# Altium schematic sheet CPU_ETH_RGMII1_SW.SchDoc
size 420 x 297 mm; SheetNumber: 17; SheetTotal: 32; DocumentTypeShort: Э3; DocumentInvertoryNumber: ㅤ
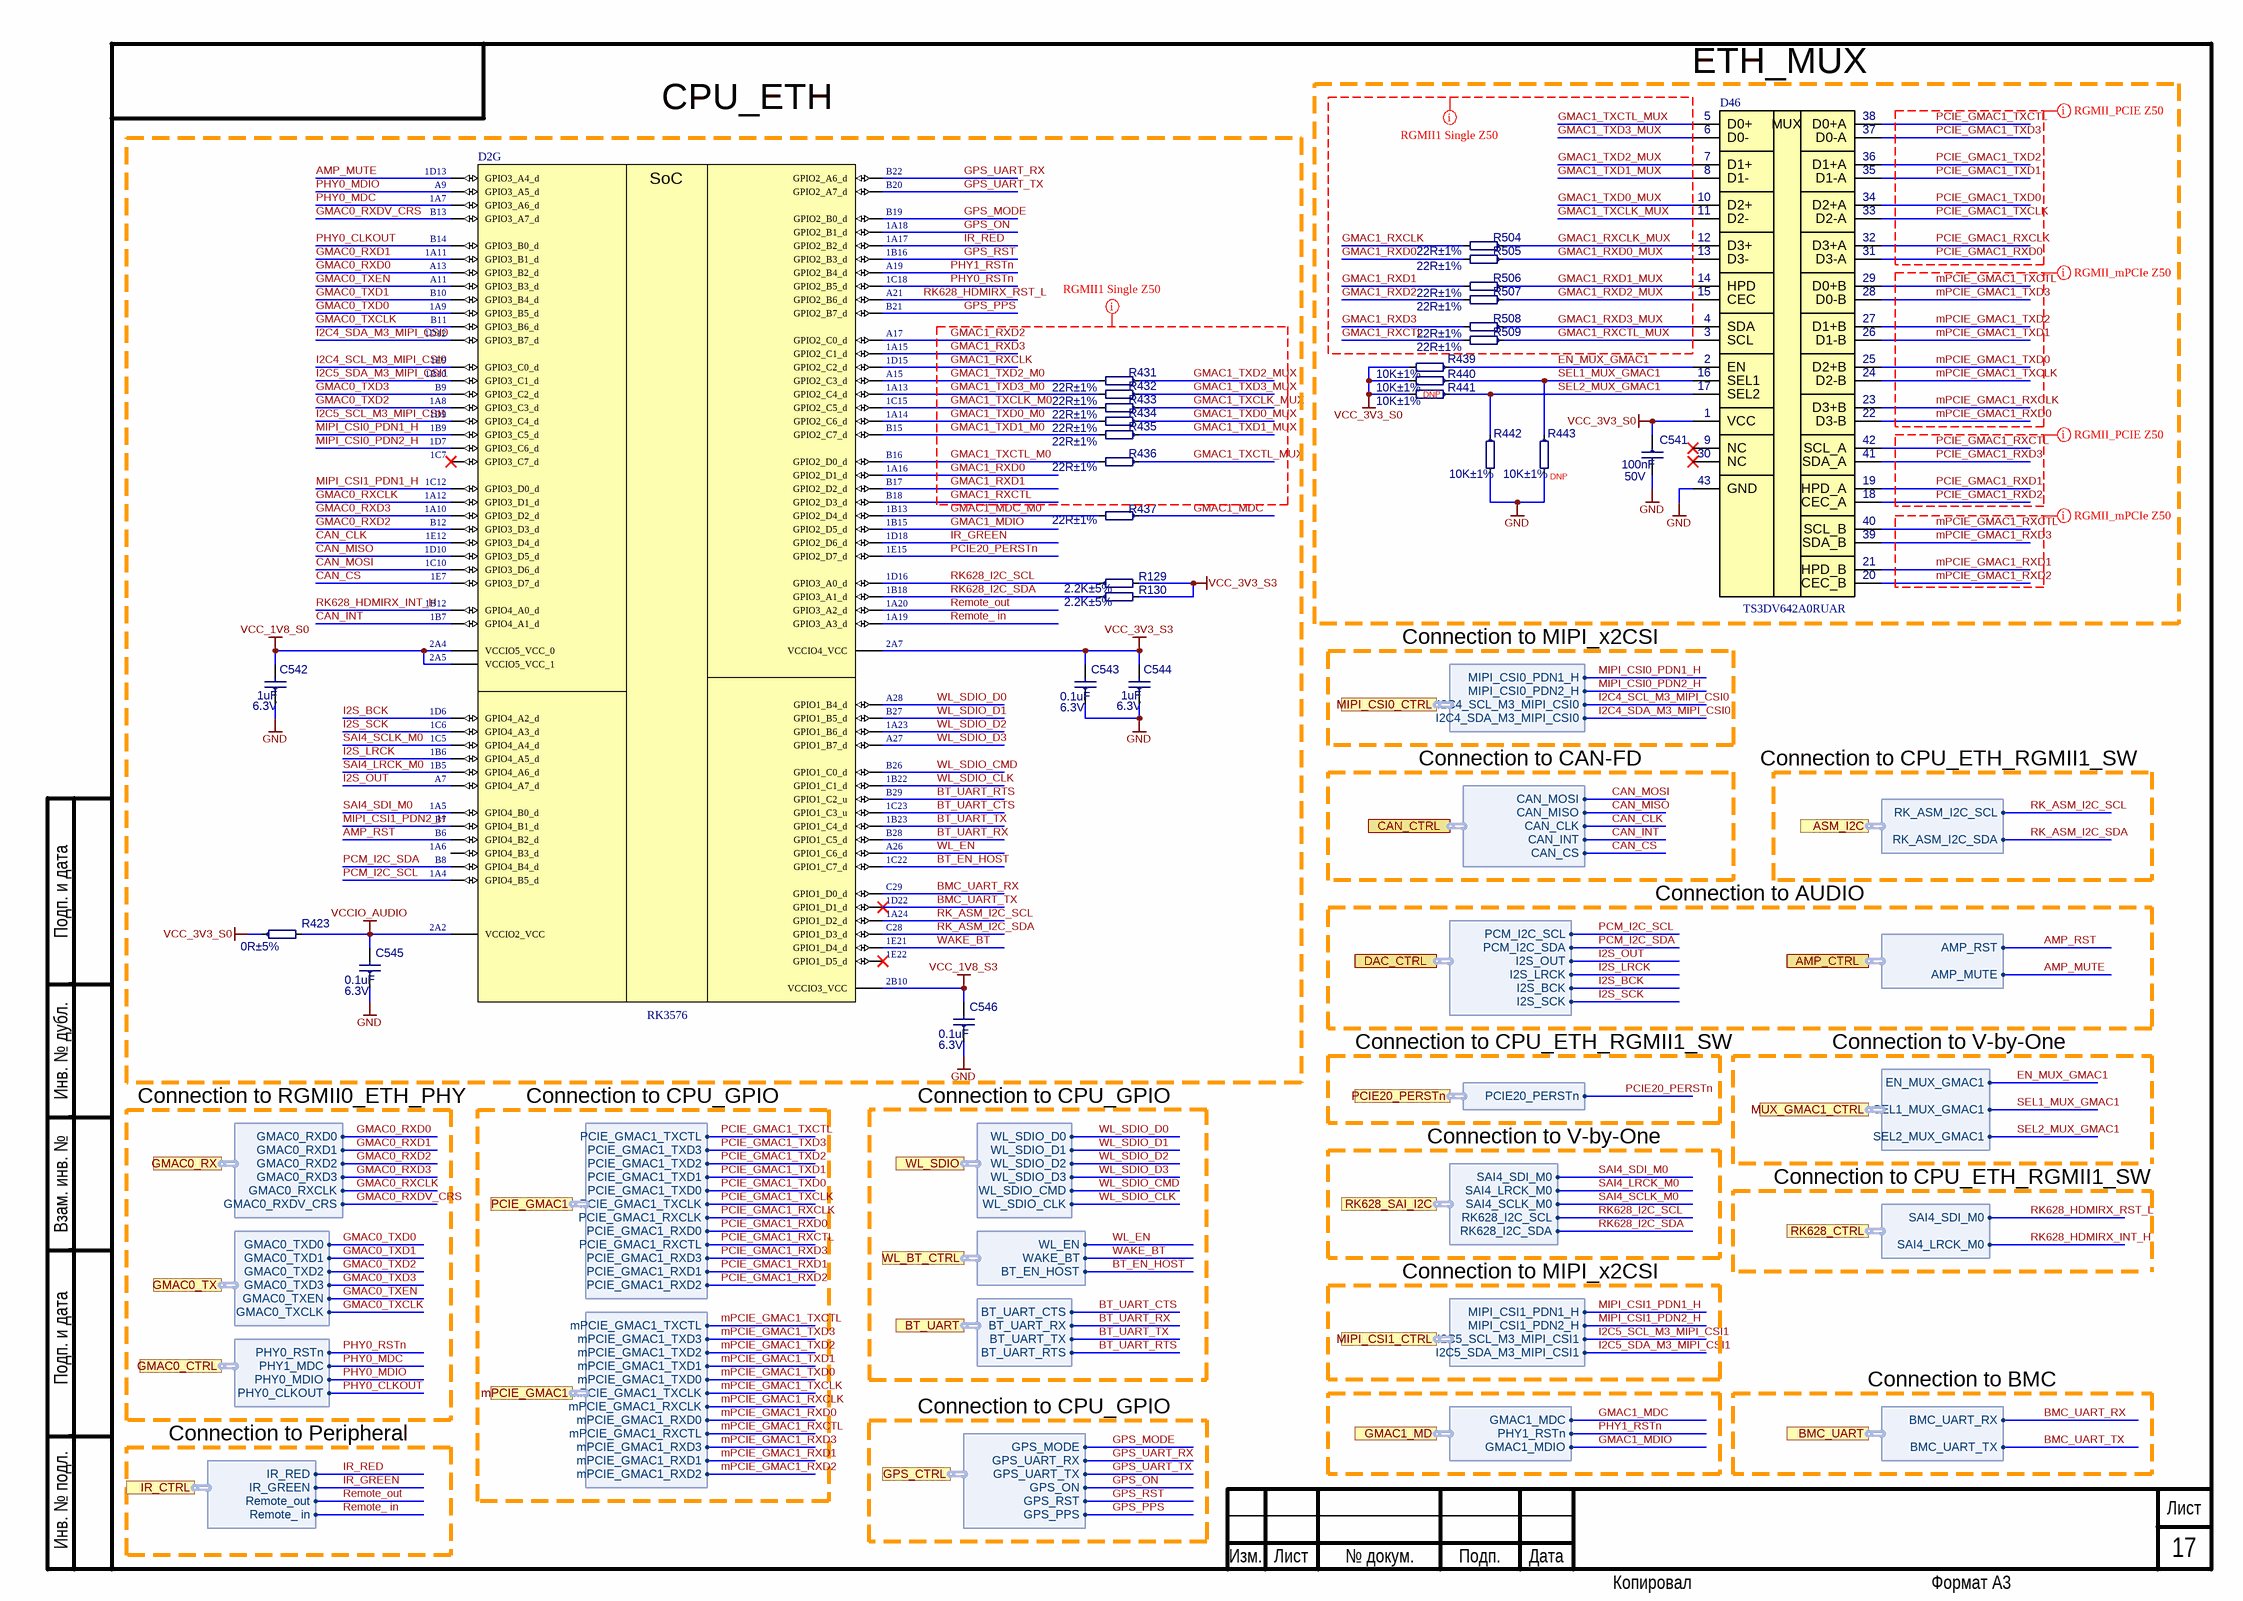
[diagram p0: CPU_ETH_RGMII1_SW.SchDoc]

## Parts
C541  100nF  Voltage: 50V  [C0402]
C542  1uF  Voltage: 6.3V  [C0201]
C543  0.1uF  Voltage: 6.3V  [C0201]
C544  1uF  Voltage: 6.3V  [C0201]
C545  0.1uF  Voltage: 6.3V  [C0201]
C546  0.1uF  Voltage: 6.3V  [C0201]
D2  RK3576  [BGAFCCSP698L]  (part G of 7)
D46  TS3DV642A0RUAR  [TS3DV642A0RUAR]
R129  2.2K±5%  [R0402]
R130  2.2K±5%  [R0402]
R423  0R±5%  [R0402]
R431  22R±1%  [R0402]
R432  22R±1%  [R0402]
R433  22R±1%  [R0402]
R434  22R±1%  [R0402]
R435  22R±1%  [R0402]
R436  22R±1%  [R0402]
R437  22R±1%  [R0402]
R439  10K±1%  [R0402]
R440  10K±1%  [R0402]
R441  10K±1%  [R0402]
R442  10K±1%  [R0402]
R443  10K±1%  [R0402]
R504  22R±1%  [R0402]
R505  22R±1%  [R0402]
R506  22R±1%  [R0402]
R507  22R±1%  [R0402]
R508  22R±1%  [R0402]
R509  22R±1%  [R0402]

## Ports
AMP_CTRL (harness AMP_CTRL), ASM_I2C (harness ASM_I2C), BMC_UART (harness BMC_UART), BT_UART (harness BT_UART), CAN_CTRL (harness CAN_CTRL), DAC_CTRL (harness DAC_CTRL), GMAC0_CTRL (harness GMAC0_CTRL), GMAC0_RX (harness GMAC0_RX), GMAC0_TX (harness GMAC0_TX), GMAC1_MD (harness GMAC1_MD), GPS_CTRL (harness GPS_CTRL), IR_CTRL (harness IR_CTRL), MIPI_CSI0_CTRL (harness MIPI_CSI0_CTRL), MIPI_CSI1_CTRL (harness MIPI_CSI1_CTRL), mPCIE_GMAC1 (harness mPCIE_GMAC1), MUX_GMAC1_CTRL (harness MUX_GMAC1_CTRL), PCIE20_PERSTn (harness PCIE20_PERSTn), PCIE_GMAC1 (harness PCIE_GMAC1), RK628_CTRL (harness RK628_CTRL), RK628_SAI_I2C (harness RK628_SAI_I2C), WL_BT_CTRL (harness WL_BT_CTRL), WL_SDIO (harness WL_SDIO)

## Harnesses
GMAC0_RX: GMAC0_RXD1, GMAC0_RXD2, GMAC0_RXD3, GMAC0_RXD0, GMAC0_RXCLK, GMAC0_RXDV_CRS
GMAC0_TX: GMAC0_TXD1, GMAC0_TXD2, GMAC0_TXD3, GMAC0_TXD0, GMAC0_TXEN, GMAC0_TXCLK
GMAC0_CTRL: PHY0_RSTn, PHY1_MDC, PHY0_MDIO, PHY0_CLKOUT
PCIE_GMAC1: PCIE_GMAC1_TXD3, PCIE_GMAC1_TXD2, PCIE_GMAC1_TXD1, PCIE_GMAC1_TXCTL, PCIE_GMAC1_TXD0, PCIE_GMAC1_TXCLK, PCIE_GMAC1_RXCLK, PCIE_GMAC1_RXD0, PCIE_GMAC1_RXCTL, PCIE_GMAC1_RXD3, PCIE_GMAC1_RXD1, PCIE_GMAC1_RXD2
mPCIE_GMAC1: mPCIE_GMAC1_TXD3, mPCIE_GMAC1_TXD2, mPCIE_GMAC1_TXD1, mPCIE_GMAC1_TXCTL, mPCIE_GMAC1_TXD0, mPCIE_GMAC1_TXCLK, mPCIE_GMAC1_RXCLK, mPCIE_GMAC1_RXD0, mPCIE_GMAC1_RXCTL, mPCIE_GMAC1_RXD3, mPCIE_GMAC1_RXD1, mPCIE_GMAC1_RXD2
WL_SDIO: WL_SDIO_D1, WL_SDIO_D2, WL_SDIO_D3, WL_SDIO_D0, WL_SDIO_CMD, WL_SDIO_CLK
BT_UART: BT_UART_CTS, BT_UART_RX, BT_UART_TX, BT_UART_RTS
RK628_SAI_I2C: SAI4_LRCK_M0, SAI4_SCLK_M0, SAI4_SDI_M0, RK628_I2C_SCL, RK628_I2C_SDA
MIPI_CSI1_CTRL: I2C5_SDA_M3_MIPI_CSI1, I2C5_SCL_M3_MIPI_CSI1, MIPI_CSI1_PDN2_H, MIPI_CSI1_PDN1_H
MUX_GMAC1_CTRL: SEL1_MUX_GMAC1, EN_MUX_GMAC1, SEL2_MUX_GMAC1
RK628_CTRL: SAI4_LRCK_M0, SAI4_SDI_M0
WL_BT_CTRL: WAKE_BT, WL_EN, BT_EN_HOST
GPS_CTRL: GPS_MODE, GPS_UART_TX, GPS_UART_RX, GPS_ON, GPS_RST, GPS_PPS
AMP_CTRL: AMP_MUTE, AMP_RST
DAC_CTRL: PCM_I2C_SDA, PCM_I2C_SCL, I2S_OUT, I2S_LRCK, I2S_BCK, I2S_SCK
CAN_CTRL: CAN_MISO, CAN_MOSI, CAN_CLK, CAN_INT, CAN_CS
ASM_I2C: RK_ASM_I2C_SCL, RK_ASM_I2C_SDA
BMC_UART: BMC_UART_RX, BMC_UART_TX
GMAC1_MD: GMAC1_MDC, GMAC1_MDIO, PHY1_RSTn
PCIE20_PERSTn: PCIE20_PERSTn
IR_CTRL: Remote_out, IR_GREEN, IR_RED, Remote_ in
MIPI_CSI0_CTRL: I2C4_SDA_M3_MIPI_CSI0, I2C4_SCL_M3_MIPI_CSI0, MIPI_CSI0_PDN2_H, MIPI_CSI0_PDN1_H

## Nets
GND: C541.2 C542.1 C543.1 C544.1 C545.1 C546.1 D46.43(GND) R442.2 R443.2
VCC_1V8_S0: C542.2 D2.2A4(VCCIO5_VCC_0) D2.2A5(VCCIO5_VCC_1)
VCC_1V8_S3: C546.2 D2.2B10(VCCIO3_VCC)
VCC_3V3_S0: C541.1 D46.1(VCC) R423.1 R439.2 R440.2 R441.2
VCC_3V3_S3: C543.2 C544.2 D2.2A7(VCCIO4_VCC) R129.2 R130.2
VCCIO_AUDIO: C545.2 D2.2A2(VCCIO2_VCC) R423.2
AMP_MUTE: D2.1D13(GPIO3_A4_d) ; port AMP_CTRL.AMP_MUTE
AMP_RST: D2.B6(GPIO4_B2_d) ; port AMP_CTRL.AMP_RST
BMC_UART_RX: D2.C29(GPIO1_D0_d) ; port BMC_UART.BMC_UART_RX
BMC_UART_TX: D2.1D22(GPIO1_D1_d) ; port BMC_UART.BMC_UART_TX
BT_EN_HOST: D2.1C22(GPIO1_C7_d) ; port WL_BT_CTRL.BT_EN_HOST
BT_UART_CTS: D2.1C23(GPIO1_C3_u) ; port BT_UART.BT_UART_CTS
BT_UART_RTS: D2.B29(GPIO1_C2_u) ; port BT_UART.BT_UART_RTS
BT_UART_RX: D2.B28(GPIO1_C5_d) ; port BT_UART.BT_UART_RX
BT_UART_TX: D2.1B23(GPIO1_C4_d) ; port BT_UART.BT_UART_TX
CAN_CLK: D2.1E12(GPIO3_D4_d) ; port CAN_CTRL.CAN_CLK
CAN_CS: D2.1E7(GPIO3_D7_d) ; port CAN_CTRL.CAN_CS
CAN_INT: D2.1B7(GPIO4_A1_d) ; port CAN_CTRL.CAN_INT
CAN_MISO: D2.1D10(GPIO3_D5_d) ; port CAN_CTRL.CAN_MISO
CAN_MOSI: D2.1C10(GPIO3_D6_d) ; port CAN_CTRL.CAN_MOSI
EN_MUX_GMAC1: D46.2(EN) R439.1 ; port MUX_GMAC1_CTRL.EN_MUX_GMAC1
GMAC0_RXCLK: D2.1A12(GPIO3_D1_d) ; port GMAC0_RX.GMAC0_RXCLK
GMAC0_RXD0: D2.A13(GPIO3_B2_d) ; port GMAC0_RX.GMAC0_RXD0
GMAC0_RXD1: D2.1A11(GPIO3_B1_d) ; port GMAC0_RX.GMAC0_RXD1
GMAC0_RXD2: D2.B12(GPIO3_D3_d) ; port GMAC0_RX.GMAC0_RXD2
GMAC0_RXD3: D2.1A10(GPIO3_D2_d) ; port GMAC0_RX.GMAC0_RXD3
GMAC0_RXDV_CRS: D2.B13(GPIO3_A7_d) ; port GMAC0_RX.GMAC0_RXDV_CRS
GMAC0_TXCLK: D2.B11(GPIO3_B6_d) ; port GMAC0_TX.GMAC0_TXCLK
GMAC0_TXD0: D2.1A9(GPIO3_B5_d) ; port GMAC0_TX.GMAC0_TXD0
GMAC0_TXD1: D2.B10(GPIO3_B4_d) ; port GMAC0_TX.GMAC0_TXD1
GMAC0_TXD2: D2.1A8(GPIO3_C3_d) ; port GMAC0_TX.GMAC0_TXD2
GMAC0_TXD3: D2.B9(GPIO3_C2_d) ; port GMAC0_TX.GMAC0_TXD3
GMAC0_TXEN: D2.A11(GPIO3_B3_d) ; port GMAC0_TX.GMAC0_TXEN
GMAC1_MDC: R437.1 ; port GMAC1_MD.GMAC1_MDC
GMAC1_MDC_M0: D2.1B13(GPIO2_D4_d) R437.2
GMAC1_MDIO: D2.1B15(GPIO2_D5_d) ; port GMAC1_MD.GMAC1_MDIO
GMAC1_RXCLK: D2.1D15(GPIO2_C2_d) R504.2
GMAC1_RXCLK_MUX: D46.12(D3+) R504.1
GMAC1_RXCTL: D2.B18(GPIO2_D3_d) R509.2
GMAC1_RXCTL_MUX: D46.3(SCL) R509.1
GMAC1_RXD0: D2.1A16(GPIO2_D1_d) R505.2
GMAC1_RXD0_MUX: D46.13(D3-) R505.1
GMAC1_RXD1: D2.B17(GPIO2_D2_d) R506.2
GMAC1_RXD1_MUX: D46.14(HPD) R506.1
GMAC1_RXD2: D2.A17(GPIO2_C0_d) R507.2
GMAC1_RXD2_MUX: D46.15(CEC) R507.1
GMAC1_RXD3: D2.1A15(GPIO2_C1_d) R508.2
GMAC1_RXD3_MUX: D46.4(SDA) R508.1
GMAC1_TXCLK_M0: D2.1C15(GPIO2_C5_d) R433.2
GMAC1_TXCLK_MUX: D46.11(D2-) R433.1
GMAC1_TXCTL_M0: D2.B16(GPIO2_D0_d) R436.2
GMAC1_TXCTL_MUX: D46.5(D0+) R436.1
GMAC1_TXD0_M0: D2.1A14(GPIO2_C6_d) R434.2
GMAC1_TXD0_MUX: D46.10(D2+) R434.1
GMAC1_TXD1_M0: D2.B15(GPIO2_C7_d) R435.2
GMAC1_TXD1_MUX: D46.8(D1-) R435.1
GMAC1_TXD2_M0: D2.A15(GPIO2_C3_d) R431.2
GMAC1_TXD2_MUX: D46.7(D1+) R431.1
GMAC1_TXD3_M0: D2.1A13(GPIO2_C4_d) R432.2
GMAC1_TXD3_MUX: D46.6(D0-) R432.1
GPS_MODE: D2.B19(GPIO2_B0_d) ; port GPS_CTRL.GPS_MODE
GPS_ON: D2.1A18(GPIO2_B1_d) ; port GPS_CTRL.GPS_ON
GPS_PPS: D2.B21(GPIO2_B7_d) ; port GPS_CTRL.GPS_PPS
GPS_RST: D2.1B16(GPIO2_B3_d) ; port GPS_CTRL.GPS_RST
GPS_UART_RX: D2.B22(GPIO2_A6_d) ; port GPS_CTRL.GPS_UART_RX
GPS_UART_TX: D2.B20(GPIO2_A7_d) ; port GPS_CTRL.GPS_UART_TX
I2C4_SCL_M3_MIPI_CSI0: D2.1E9(GPIO3_C0_d) ; port MIPI_CSI0_CTRL.I2C4_SCL_M3_MIPI_CSI0
I2C4_SDA_M3_MIPI_CSI0: D2.1D12(GPIO3_B7_d) ; port MIPI_CSI0_CTRL.I2C4_SDA_M3_MIPI_CSI0
I2C5_SCL_M3_MIPI_CSI1: D2.1D9(GPIO3_C4_d) ; port MIPI_CSI1_CTRL.I2C5_SCL_M3_MIPI_CSI1
I2C5_SDA_M3_MIPI_CSI1: D2.1B10(GPIO3_C1_d) ; port MIPI_CSI1_CTRL.I2C5_SDA_M3_MIPI_CSI1
I2S_BCK: D2.1D6(GPIO4_A2_d) ; port DAC_CTRL.I2S_BCK
I2S_LRCK: D2.1B6(GPIO4_A5_d) ; port DAC_CTRL.I2S_LRCK
I2S_OUT: D2.A7(GPIO4_A7_d) ; port DAC_CTRL.I2S_OUT
I2S_SCK: D2.1C6(GPIO4_A3_d) ; port DAC_CTRL.I2S_SCK
IR_GREEN: D2.1D18(GPIO2_D6_d) ; port IR_CTRL.IR_GREEN
IR_RED: D2.1A17(GPIO2_B2_d) ; port IR_CTRL.IR_RED
MIPI_CSI0_PDN1_H: D2.1B9(GPIO3_C5_d) ; port MIPI_CSI0_CTRL.MIPI_CSI0_PDN1_H
MIPI_CSI0_PDN2_H: D2.1D7(GPIO3_C6_d) ; port MIPI_CSI0_CTRL.MIPI_CSI0_PDN2_H
MIPI_CSI1_PDN1_H: D2.1C12(GPIO3_D0_d) ; port MIPI_CSI1_CTRL.MIPI_CSI1_PDN1_H
MIPI_CSI1_PDN2_H: D2.B7(GPIO4_B1_d) ; port MIPI_CSI1_CTRL.MIPI_CSI1_PDN2_H
mPCIE_GMAC1_RXCLK: D46.23(D3+B) ; port mPCIE_GMAC1.mPCIE_GMAC1_RXCLK
mPCIE_GMAC1_RXCTL: D46.40(SCL_B) ; port mPCIE_GMAC1.mPCIE_GMAC1_RXCTL
mPCIE_GMAC1_RXD0: D46.22(D3-B) ; port mPCIE_GMAC1.mPCIE_GMAC1_RXD0
mPCIE_GMAC1_RXD1: D46.21(HPD_B) ; port mPCIE_GMAC1.mPCIE_GMAC1_RXD1
mPCIE_GMAC1_RXD2: D46.20(CEC_B) ; port mPCIE_GMAC1.mPCIE_GMAC1_RXD2
mPCIE_GMAC1_RXD3: D46.39(SDA_B) ; port mPCIE_GMAC1.mPCIE_GMAC1_RXD3
mPCIE_GMAC1_TXCLK: D46.24(D2-B) ; port mPCIE_GMAC1.mPCIE_GMAC1_TXCLK
mPCIE_GMAC1_TXCTL: D46.29(D0+B) ; port mPCIE_GMAC1.mPCIE_GMAC1_TXCTL
mPCIE_GMAC1_TXD0: D46.25(D2+B) ; port mPCIE_GMAC1.mPCIE_GMAC1_TXD0
mPCIE_GMAC1_TXD1: D46.26(D1-B) ; port mPCIE_GMAC1.mPCIE_GMAC1_TXD1
mPCIE_GMAC1_TXD2: D46.27(D1+B) ; port mPCIE_GMAC1.mPCIE_GMAC1_TXD2
mPCIE_GMAC1_TXD3: D46.28(D0-B) ; port mPCIE_GMAC1.mPCIE_GMAC1_TXD3
PCIE20_PERSTn: D2.1E15(GPIO2_D7_d) ; port PCIE20_PERSTn.PCIE20_PERSTn
PCIE_GMAC1_RXCLK: D46.32(D3+A) ; port PCIE_GMAC1.PCIE_GMAC1_RXCLK
PCIE_GMAC1_RXCTL: D46.42(SCL_A) ; port PCIE_GMAC1.PCIE_GMAC1_RXCTL
PCIE_GMAC1_RXD0: D46.31(D3-A) ; port PCIE_GMAC1.PCIE_GMAC1_RXD0
PCIE_GMAC1_RXD1: D46.19(HPD_A) ; port PCIE_GMAC1.PCIE_GMAC1_RXD1
PCIE_GMAC1_RXD2: D46.18(CEC_A) ; port PCIE_GMAC1.PCIE_GMAC1_RXD2
PCIE_GMAC1_RXD3: D46.41(SDA_A) ; port PCIE_GMAC1.PCIE_GMAC1_RXD3
PCIE_GMAC1_TXCLK: D46.33(D2-A) ; port PCIE_GMAC1.PCIE_GMAC1_TXCLK
PCIE_GMAC1_TXCTL: D46.38(D0+A) ; port PCIE_GMAC1.PCIE_GMAC1_TXCTL
PCIE_GMAC1_TXD0: D46.34(D2+A) ; port PCIE_GMAC1.PCIE_GMAC1_TXD0
PCIE_GMAC1_TXD1: D46.35(D1-A) ; port PCIE_GMAC1.PCIE_GMAC1_TXD1
PCIE_GMAC1_TXD2: D46.36(D1+A) ; port PCIE_GMAC1.PCIE_GMAC1_TXD2
PCIE_GMAC1_TXD3: D46.37(D0-A) ; port PCIE_GMAC1.PCIE_GMAC1_TXD3
PCM_I2C_SCL: D2.1A4(GPIO4_B5_d) ; port DAC_CTRL.PCM_I2C_SCL
PCM_I2C_SDA: D2.B8(GPIO4_B4_d) ; port DAC_CTRL.PCM_I2C_SDA
PHY0_CLKOUT: D2.B14(GPIO3_B0_d) ; port GMAC0_CTRL.PHY0_CLKOUT
PHY0_MDC: D2.1A7(GPIO3_A6_d) ; port GMAC0_CTRL.PHY1_MDC
PHY0_MDIO: D2.A9(GPIO3_A5_d) ; port GMAC0_CTRL.PHY0_MDIO
PHY0_RSTn: D2.1C18(GPIO2_B5_d) ; port GMAC0_CTRL.PHY0_RSTn
PHY1_RSTn: D2.A19(GPIO2_B4_d) ; port GMAC1_MD.PHY1_RSTn
Remote_ in: D2.1A19(GPIO3_A3_d) ; port IR_CTRL.Remote_ in
Remote_out: D2.1A20(GPIO3_A2_d) ; port IR_CTRL.Remote_out
RK628_HDMIRX_INT_H: D2.1B12(GPIO4_A0_d) ; port RK628_CTRL.SAI4_LRCK_M0
RK628_HDMIRX_RST_L: D2.A21(GPIO2_B6_d) ; port RK628_CTRL.SAI4_SDI_M0
RK628_I2C_SCL: D2.1D16(GPIO3_A0_d) R129.1 ; port RK628_SAI_I2C.RK628_I2C_SCL
RK628_I2C_SDA: D2.1B18(GPIO3_A1_d) R130.1 ; port RK628_SAI_I2C.RK628_I2C_SDA
RK_ASM_I2C_SCL: D2.1A24(GPIO1_D2_d) ; port ASM_I2C.RK_ASM_I2C_SCL
RK_ASM_I2C_SDA: D2.C28(GPIO1_D3_d) ; port ASM_I2C.RK_ASM_I2C_SDA
SAI4_LRCK_M0: D2.1B5(GPIO4_A6_d) ; port RK628_SAI_I2C.SAI4_LRCK_M0
SAI4_SCLK_M0: D2.1C5(GPIO4_A4_d) ; port RK628_SAI_I2C.SAI4_SCLK_M0
SAI4_SDI_M0: D2.1A5(GPIO4_B0_d) ; port RK628_SAI_I2C.SAI4_SDI_M0
SEL1_MUX_GMAC1: D46.16(SEL1) R440.1 R443.1 ; port MUX_GMAC1_CTRL.SEL1_MUX_GMAC1
SEL2_MUX_GMAC1: D46.17(SEL2) R441.1 R442.1 ; port MUX_GMAC1_CTRL.SEL2_MUX_GMAC1
WAKE_BT: D2.1E21(GPIO1_D4_d) ; port WL_BT_CTRL.WAKE_BT
WL_EN: D2.A26(GPIO1_C6_d) ; port WL_BT_CTRL.WL_EN
WL_SDIO_CLK: D2.1B22(GPIO1_C1_d) ; port WL_SDIO.WL_SDIO_CLK
WL_SDIO_CMD: D2.B26(GPIO1_C0_d) ; port WL_SDIO.WL_SDIO_CMD
WL_SDIO_D0: D2.A28(GPIO1_B4_d) ; port WL_SDIO.WL_SDIO_D0
WL_SDIO_D1: D2.B27(GPIO1_B5_d) ; port WL_SDIO.WL_SDIO_D1
WL_SDIO_D2: D2.1A23(GPIO1_B6_d) ; port WL_SDIO.WL_SDIO_D2
WL_SDIO_D3: D2.A27(GPIO1_B7_d) ; port WL_SDIO.WL_SDIO_D3

Not connected (* = marked no-connect by the designer): D2 1A6(GPIO4_B3_d) 1C7(GPIO3_C7_d)* 1E22(GPIO1_D5_d)*; D46 9(NC)* 30(NC)*

## Layout directives
net class RGMII1: GMAC1_RXCLK, GMAC1_RXCLK_MUX, GMAC1_RXCTL, GMAC1_RXCTL_MUX, GMAC1_RXD0, GMAC1_RXD0_MUX, GMAC1_RXD1, GMAC1_RXD1_MUX, GMAC1_RXD2, GMAC1_RXD2_MUX, GMAC1_RXD3, GMAC1_RXD3_MUX, GMAC1_TXCLK_M0, GMAC1_TXCLK_MUX, GMAC1_TXCTL_M0, GMAC1_TXCTL_MUX, GMAC1_TXD0_M0, GMAC1_TXD0_MUX, GMAC1_TXD1_M0, GMAC1_TXD1_MUX, GMAC1_TXD2_M0, GMAC1_TXD2_MUX, GMAC1_TXD3_M0, GMAC1_TXD3_MUX
net class RGMII_PCIE: PCIE_GMAC1_RXCLK, PCIE_GMAC1_RXCTL, PCIE_GMAC1_RXD0, PCIE_GMAC1_RXD1, PCIE_GMAC1_RXD2, PCIE_GMAC1_RXD3, PCIE_GMAC1_TXCLK, PCIE_GMAC1_TXCTL, PCIE_GMAC1_TXD0, PCIE_GMAC1_TXD1, PCIE_GMAC1_TXD2, PCIE_GMAC1_TXD3
net class RGMII_mPCIe: mPCIE_GMAC1_RXCLK, mPCIE_GMAC1_RXCTL, mPCIE_GMAC1_RXD0, mPCIE_GMAC1_RXD1, mPCIE_GMAC1_RXD2, mPCIE_GMAC1_RXD3, mPCIE_GMAC1_TXCLK, mPCIE_GMAC1_TXCTL, mPCIE_GMAC1_TXD0, mPCIE_GMAC1_TXD1, mPCIE_GMAC1_TXD2, mPCIE_GMAC1_TXD3

## Notes on the sheet
- (near D46) ETH_MUX
- CPU_ETH
- (near R441) DNP
- (near R443) DNP
- Connection to MIPI_x2CSI
- Connection to CAN-FD
- Connection to CPU_ETH_RGMII1_SW
- Connection to AUDIO
- Connection to V-by-One
- Connection to RGMII0_ETH_PHY
- Connection to CPU_GPIO
- Connection to BMC
- Connection to Peripheral
- Подп. и дата
- Инв. № дубл.
- Взам. инв. №
- Инв. № подл.
- Изм.
- Лист
- № докум.
- Подп.
- Дата
- Копировал
- Формат А3
- (in symbol RK3576, part G) SoC
- (in symbol TS3DV642A0RUAR) MUX

## Library data of the parts
C541 = 0402-X7R-50V-0.1uF±10%: Ceramic Capacitor 0402 100nF ±10% 50V X7R; Manufacturer: Yageo; NameFromManufacturer: CC0402KRX7R9BB104; Place: *); Check: False; Dielectric: X7R; Case: C0402; Part Number: 0402-X7R-50V-0.1uF±10%; Value: 100nF; Tolerance: 10%; Temperature: -55°C~125°C; ComponentLink2Description: Link to datasheet; ComponentLink1Description: DATASHEET; ComponentLink2URL: https://www.lcsc.com/product-detail/Multilayer-Ceramic-Capacitors-MLCC-SMD-SMT_YAGEO-CC0402KRX7R9BB104_C131394.html; Last changed: 09.04.2025
C542 C544 = 0201-X5R-6.3V-1uF±20%: Manufacturer: Murata Electronics; NameFromManufacturer: GRM033R60J105MEA2D; Dielectric: X5R; Place: *); Tolerance: 20%; Check: False; Case: C0201; Part Number: 0201-X5R-6.3V-1uF±20%; Value: 1uF; Temperature: -55°C~85°C; ComponentLink2Description: Link to datasheet; ComponentLink1Description: DATASHEET; ComponentLink2URL: https://www.terraelectronica.ru/product/1209278; ComponentLink1URL: Datasheets/capacitors/GRM033R60J105MEA2-61A.pdf; Last changed: 27.10.2022
C543 C545 C546 = 0201-X5R-6.3V-0.1uF±10%: Manufacturer: Yageo; NameFromManufacturer: CC0201KRX5R5BB104; Dielectric: X5R; Place: *); Tolerance: 10%; Check: False; Case: C0201; Part Number: 0201-X5R-6.3V-0.1uF±10%; Value: 0.1uF; Temperature: -55°C~85°C; ComponentLink2Description: Link to datasheet; ComponentLink1Description: DATASHEET; ComponentLink2URL: https://www.terraelectronica.ru/product/1020032; ComponentLink1URL: Datasheets/capacitors/UPY-GPHC_X5R_4V-to-50V_27.pdf; Last changed: 27.10.2022
D2 = RK3576: SoC 4xCortex-A72@2.2Ghz+4xCortex-A53@2Ghz, LPDDR4/4X/5/5X, SDIO/eMMC/UFS/FSPI, BGA 16.1x17.2x1.0mm; Manufacturer: Rockship; Place: *); Check: False; Part Number: RK3576; Temperature: -40°C~85°C; Value: RK3576; ComponentLink1Description: DATASHEET; NameFromManufacturer: RK3576; ComponentLink1URL: https://wiki.friendlyelec.com/wiki/images/b/bf/Rockchip_RK3576_Datasheet_V1.5-20241216.pdf; Last changed: 06.01.2026
D46 = TS3DV642A0RUAR: 6-Gbps 12-channel differential 1-to-2 and 2-to-1 mux for DVI 1.0/ DisplayPort 1.4 /HDMI 2.0; Manufacturer: TI; Check: False; Part Number: TS3DV642A0RUAR; NameFromManufacturer: TS3DV642A0RUAR; Value: TS3DV642A0RUAR
R129 R130 = 0402-0.0625W-2.2K-100ppm±5%: *; NameFromManufacturer: RC0402JR-072K2L; Manufacturer: Yageo; Place: *); Value: 2.2K; Tolerance: 5%; Check: False; Case: R0402; Part Number: 0402-0.0625W-2.2K-100ppm±5%; Temperature: -55°C~155°C; ComponentLink1Description: DATASHEET; ComponentLink1URL: https://octopart.com/ac0402jr-072k2l-yageo-23514430?r=sp; Datasheet: Datasheets/resistors/PYu-AC_51_RoHS_L_8.pdf; Last changed: 27.10.2022
R423 = 0402-0.0625W-0R-100ppm±5%: NameFromManufacturer: RC0402JR-070RL; Manufacturer: Yageo; Place: *); Value: 0R; Tolerance: 5%; Check: False; Case: R0402; Part Number: 0402-0.0625W-0R-100ppm±5%; Temperature: -55°C~155°C; ComponentLink1Description: DATASHEET; ComponentLink1URL: https://ru.mouser.com/ProductDetail/YAGEO/RC0402JR-070RL?qs=%2Fha2pyFadugNN0LzwXn2qP7HsQ9BBU71VWxeSOFlFaYv9aVJHghTrg%3D%3D; Datasheet: Datasheets/resistors/PYu-RC_Group_51_RoHS_L_11.pdf; Last changed: 27.10.2022
R431-R437 R504-R509 = 0402-0.0625W-22R-100ppm±1%: Chip Resistor 0402 22Ω ±1% 50V ±100ppm/℃ Thick Film; NameFromManufacturer: RC0402FR-0722RL; Manufacturer: Yageo; Place: *); Value: 22R; Check: False; Case: R0402; Part Number: 0402-0.0625W-22R-100ppm±1%; Tolerance: 1%; Temperature: -55°C~155°C; ComponentLink1Description: DATASHEET; ComponentLink1URL: https://www.yageo.com/upload/media/product/productsearch/datasheet/rchip/PYu-RC_Group_51_RoHS_L_11.pdf; Datasheet: Datasheets/resistors/PYu-RC_Group_51_RoHS_L_11.pdf; Last changed: 27.10.2022
R439-R443 = 0402-0.0625W-10K-100ppm±1%: Chip Resistor 0402 10kΩ ±1% 50V ±100ppm/℃ Thick Film; NameFromManufacturer: RC0402FR-0710KL; Manufacturer: Yageo; Place: *); Value: 10K; Check: False; Case: R0402; Part Number: 0402-0.0625W-10K-100ppm±1%; Tolerance: 1%; Temperature: -55°C~155°C; ComponentLink1Description: DATASHEET; ComponentLink1URL: https://ru.mouser.com/ProductDetail/YAGEO/RC0402FR-0710KL?qs=%2Fha2pyFaduhjtLcYvKXQ8IogF7YwN7YtH%252BOO8ZtEEMnoa4yoWYcwpw%3D%3D; Datasheet: Datasheets/resistors/PYu-RC_Group_51_RoHS_L_11.pdf; Last changed: 27.10.2022